# EAGLE schematic Panelizado_frentes (EAGLE 9.6.2)

## Sheet 1 of 2: Panel Frontal
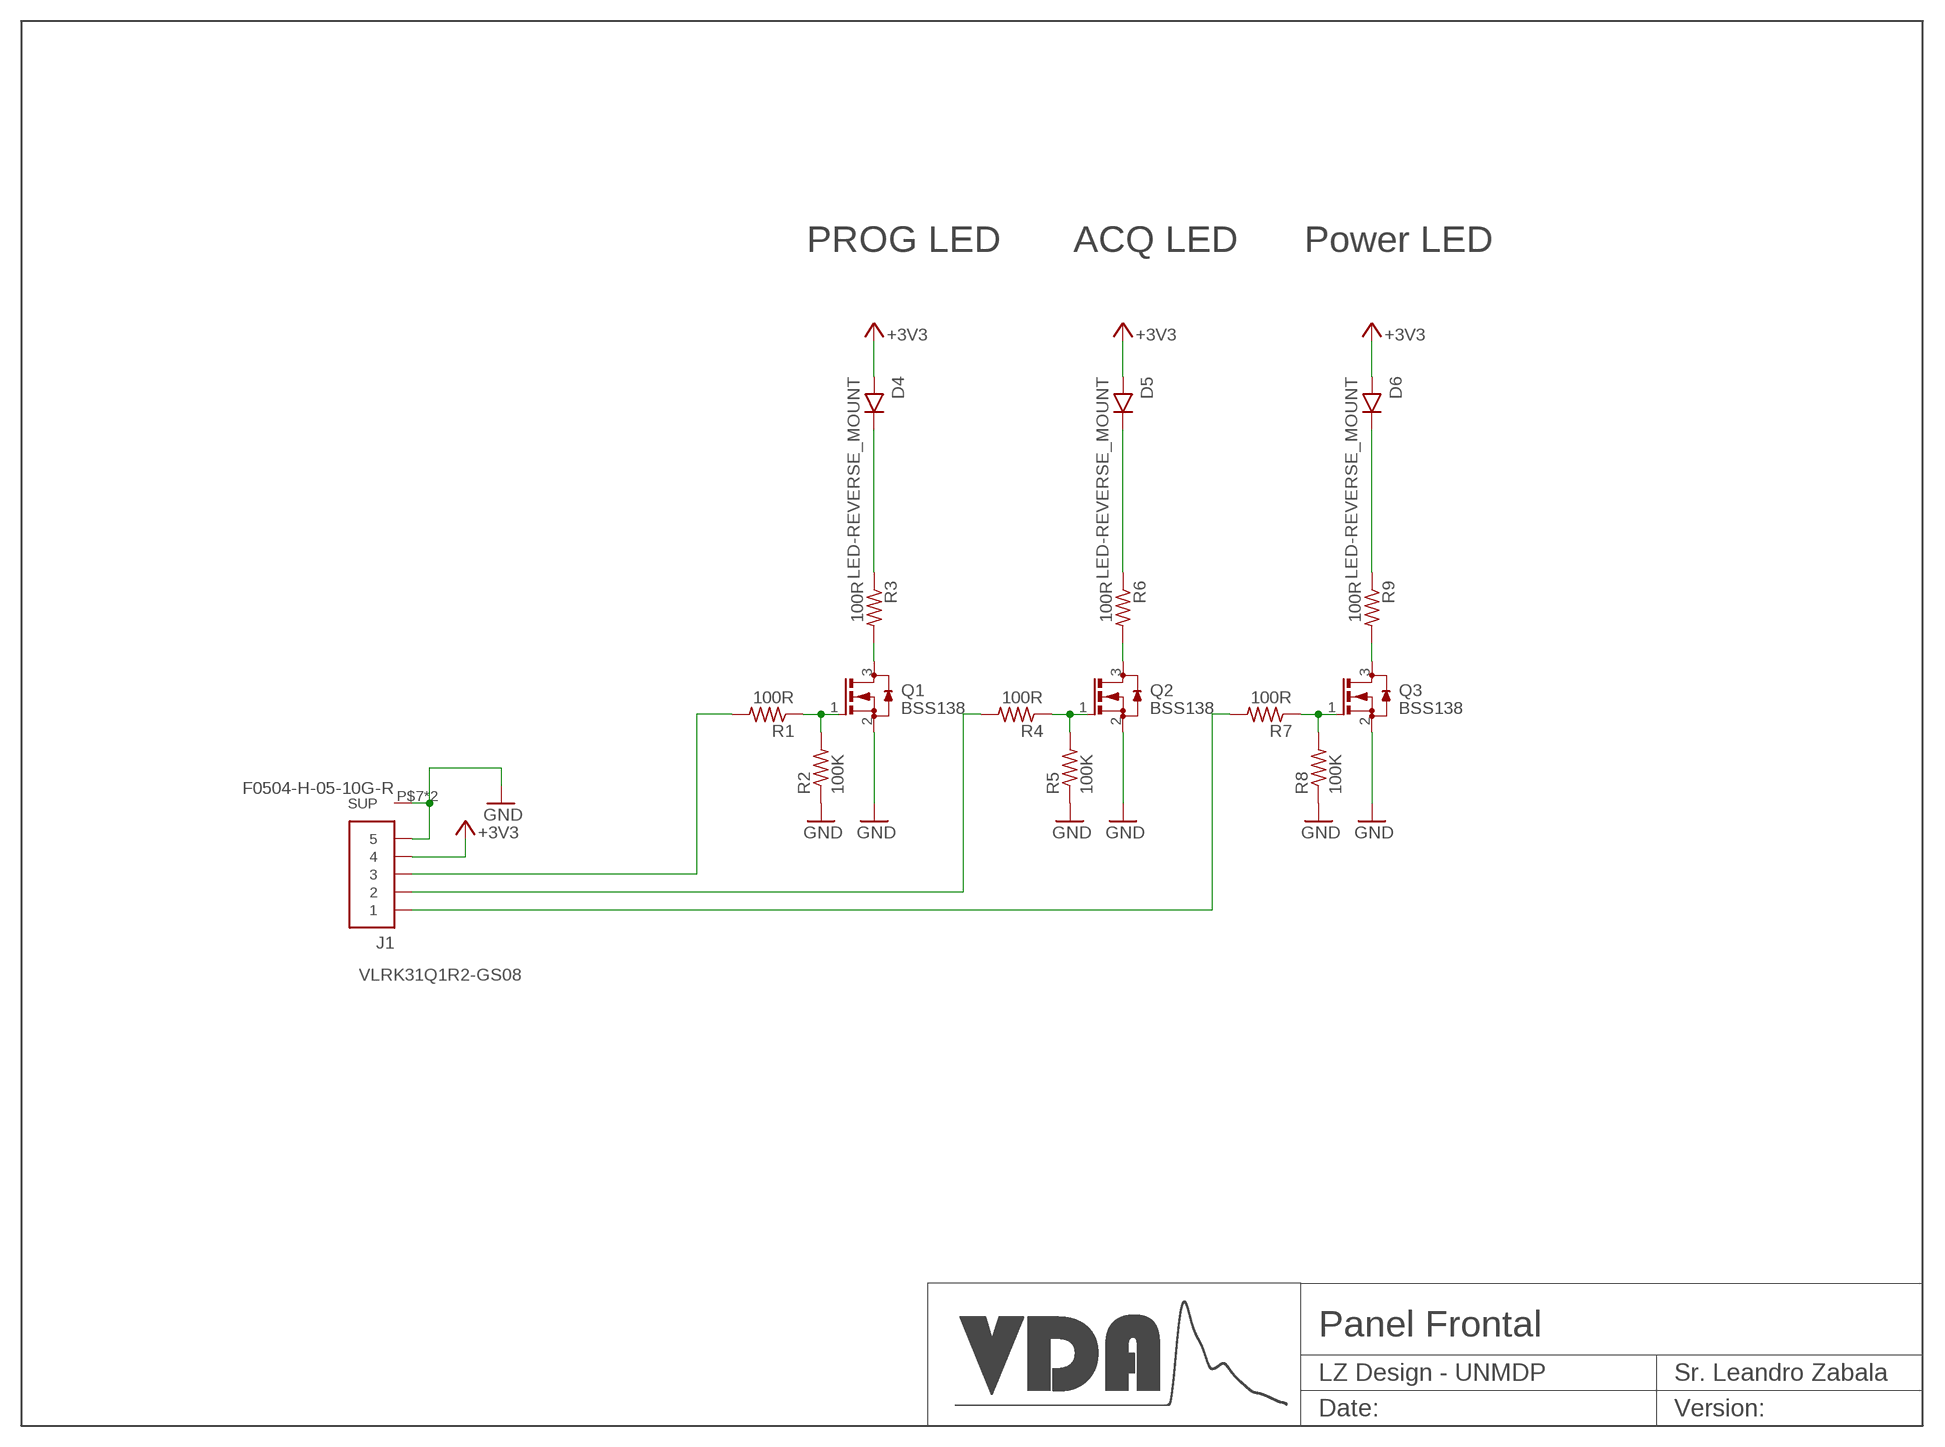
[diagram p0: schematic, sheet 1]

### Parts
D4  LED-REVERSE_MOUNT  [VLRK31]
D5  LED-REVERSE_MOUNT  [VLRK31]
D6  LED-REVERSE_MOUNT  [VLRK31]
J1  F0504-H-05-10G-R  [F0504-H-05-10G-R]
Q1  BSS138  N-MOS_SOT23-3  [SOT-23]
Q2  BSS138  N-MOS_SOT23-3  [SOT-23]
Q3  BSS138  N-MOS_SOT23-3  [SOT-23]
R1  100R  R_0603  [R_0603]
R2  100K  R_0603  [R_0603]
R3  100R  R_0603  [R_0603]
R4  100R  R_0603  [R_0603]
R5  100K  R_0603  [R_0603]
R6  100R  R_0603  [R_0603]
R7  100R  R_0603  [R_0603]
R8  100K  R_0603  [R_0603]
R9  100R  R_0603  [R_0603]

### Nets
+3V3: D4.A D5.A D6.A J1.P$4
GND: J1.P$5 J1.P$7(SUP) J1.P$8(SUP) Q1.2(S) Q2.2(S) Q3.2(S) R2.1 R5.1 R8.1
N$13: Q1.1(G) R1.1 R2.2
N$14: Q2.1(G) R4.1 R5.2
N$15: Q3.1(G) R7.1 R8.2
N$16: J1.P$3 R1.2
N$17: J1.P$2 R4.2
N$18: J1.P$1 R7.2
N$19: D4.K R3.1
N$20: Q1.3(D) R3.2
N$21: D5.K R6.1
N$22: Q2.3(D) R6.2
N$23: D6.K R9.1
N$24: Q3.3(D) R9.2

### Notes on the sheet
- PROG LED | ACQ LED | Power LED
- VLRK31Q1R2-GS08

## Sheet 2 of 2
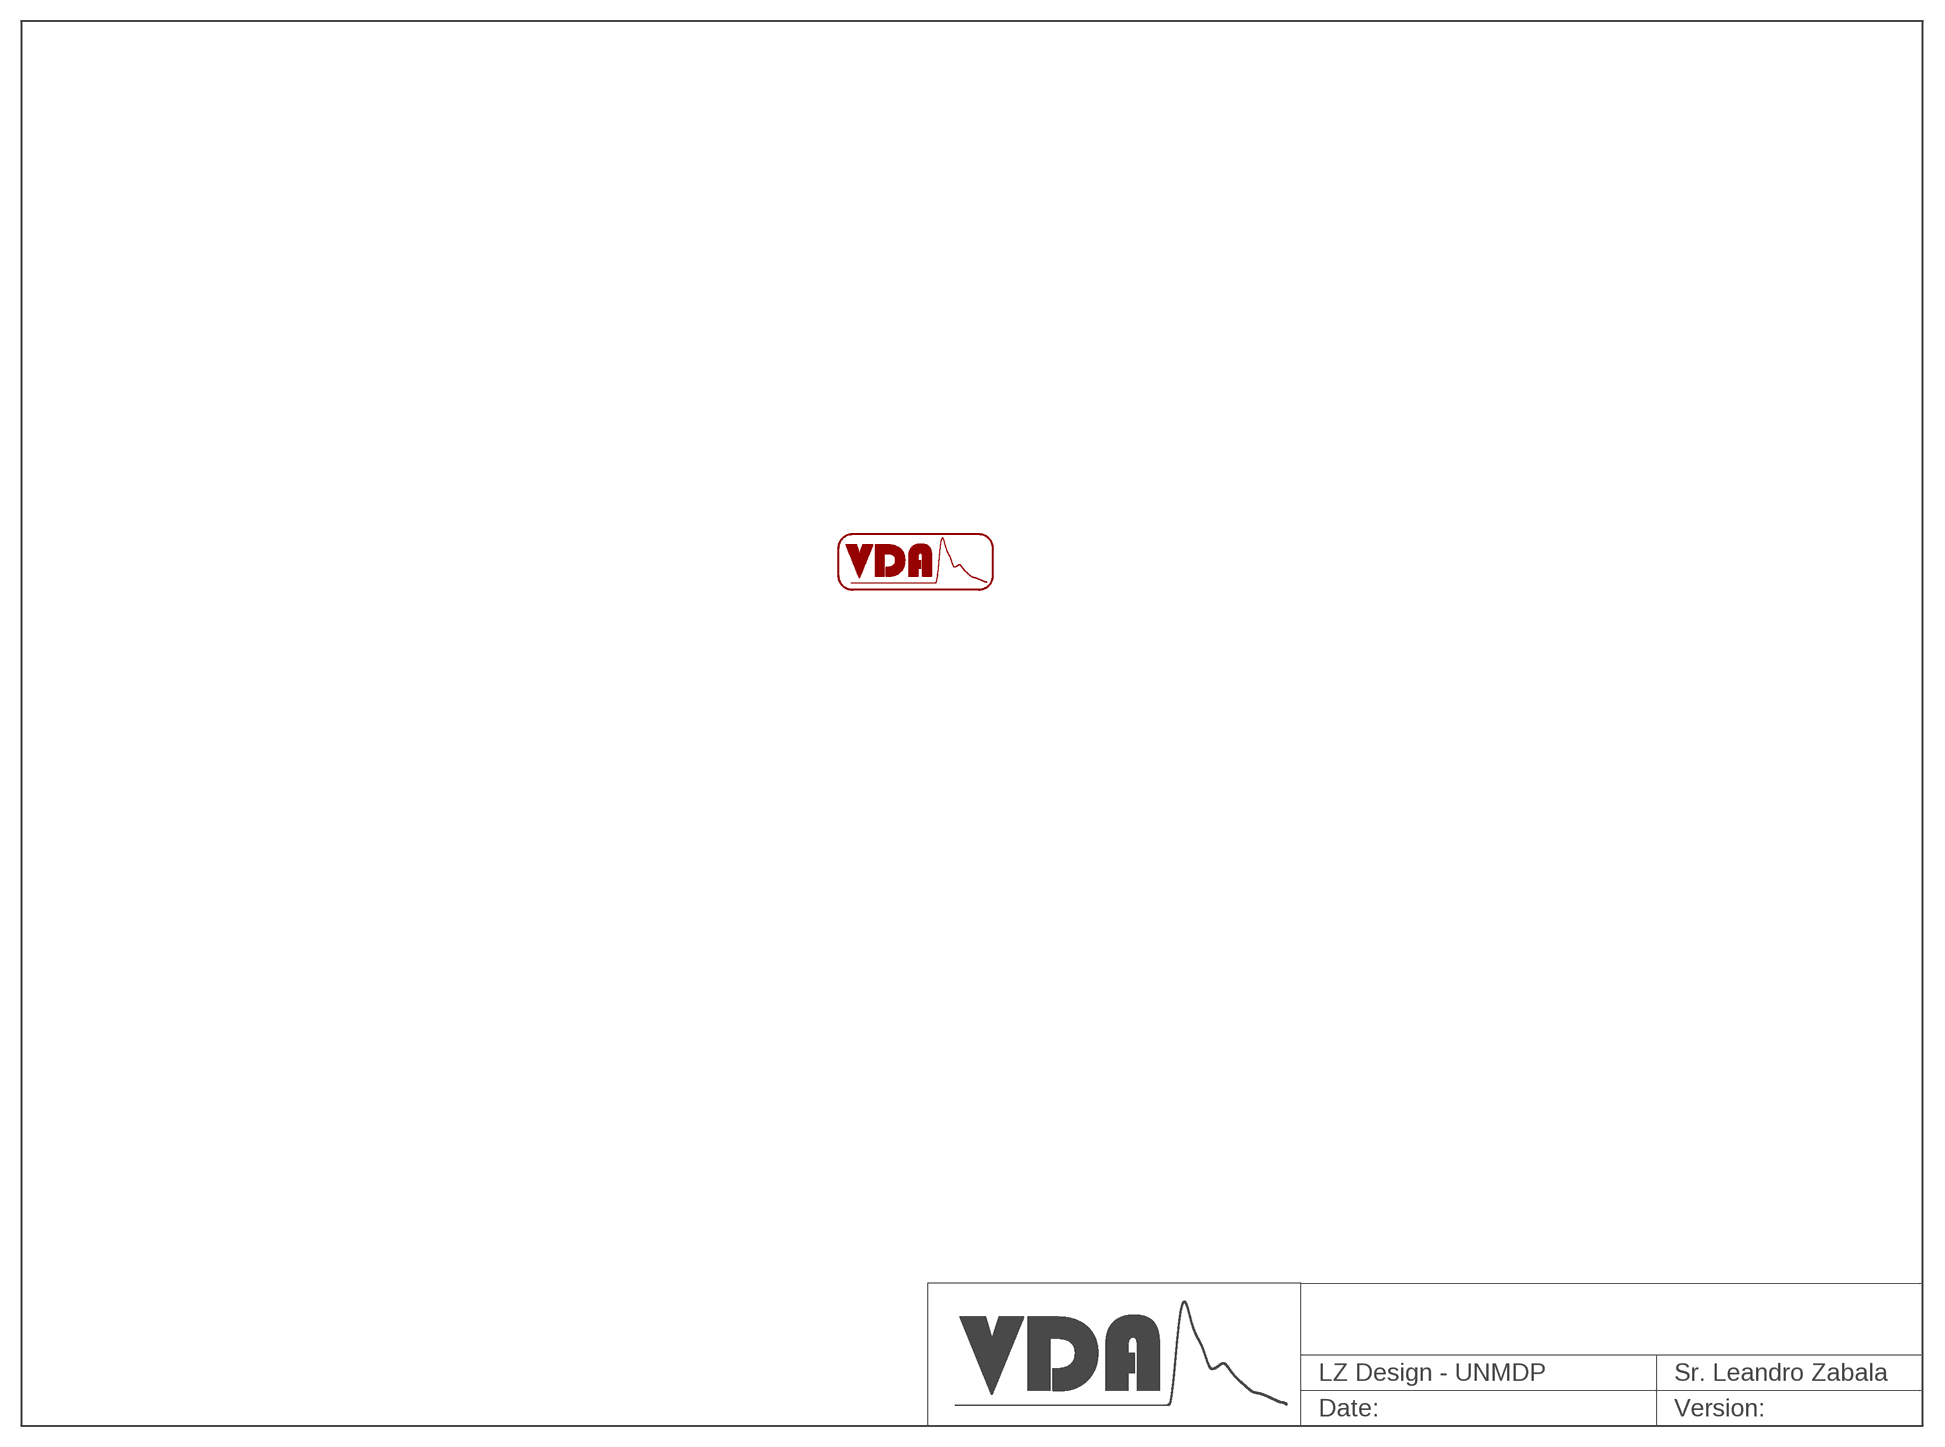
[diagram p1: schematic, sheet 2]

### Parts
U$1  LOGO_VDA-3CM  [LOGO_VDA-3CM]

## Library data of the parts
D4-D6 = property_LED:LED-REVERSE_MOUNT
J1 = property-connectors:F0504-H-05-10G-R: FFC, FPC (Flat Flexible) Connector SMD,P=0.5mm,Surface Mount，Right Angle
Q1-Q3 = Property-standar:N-MOS
R1-R9 = Property-standar:R
U$1 = Frames:LOGO_VDA